# Altium schematic sheet 22 COMM CHANNEL STEERIN.SchDoc
size 513 x 386 mm
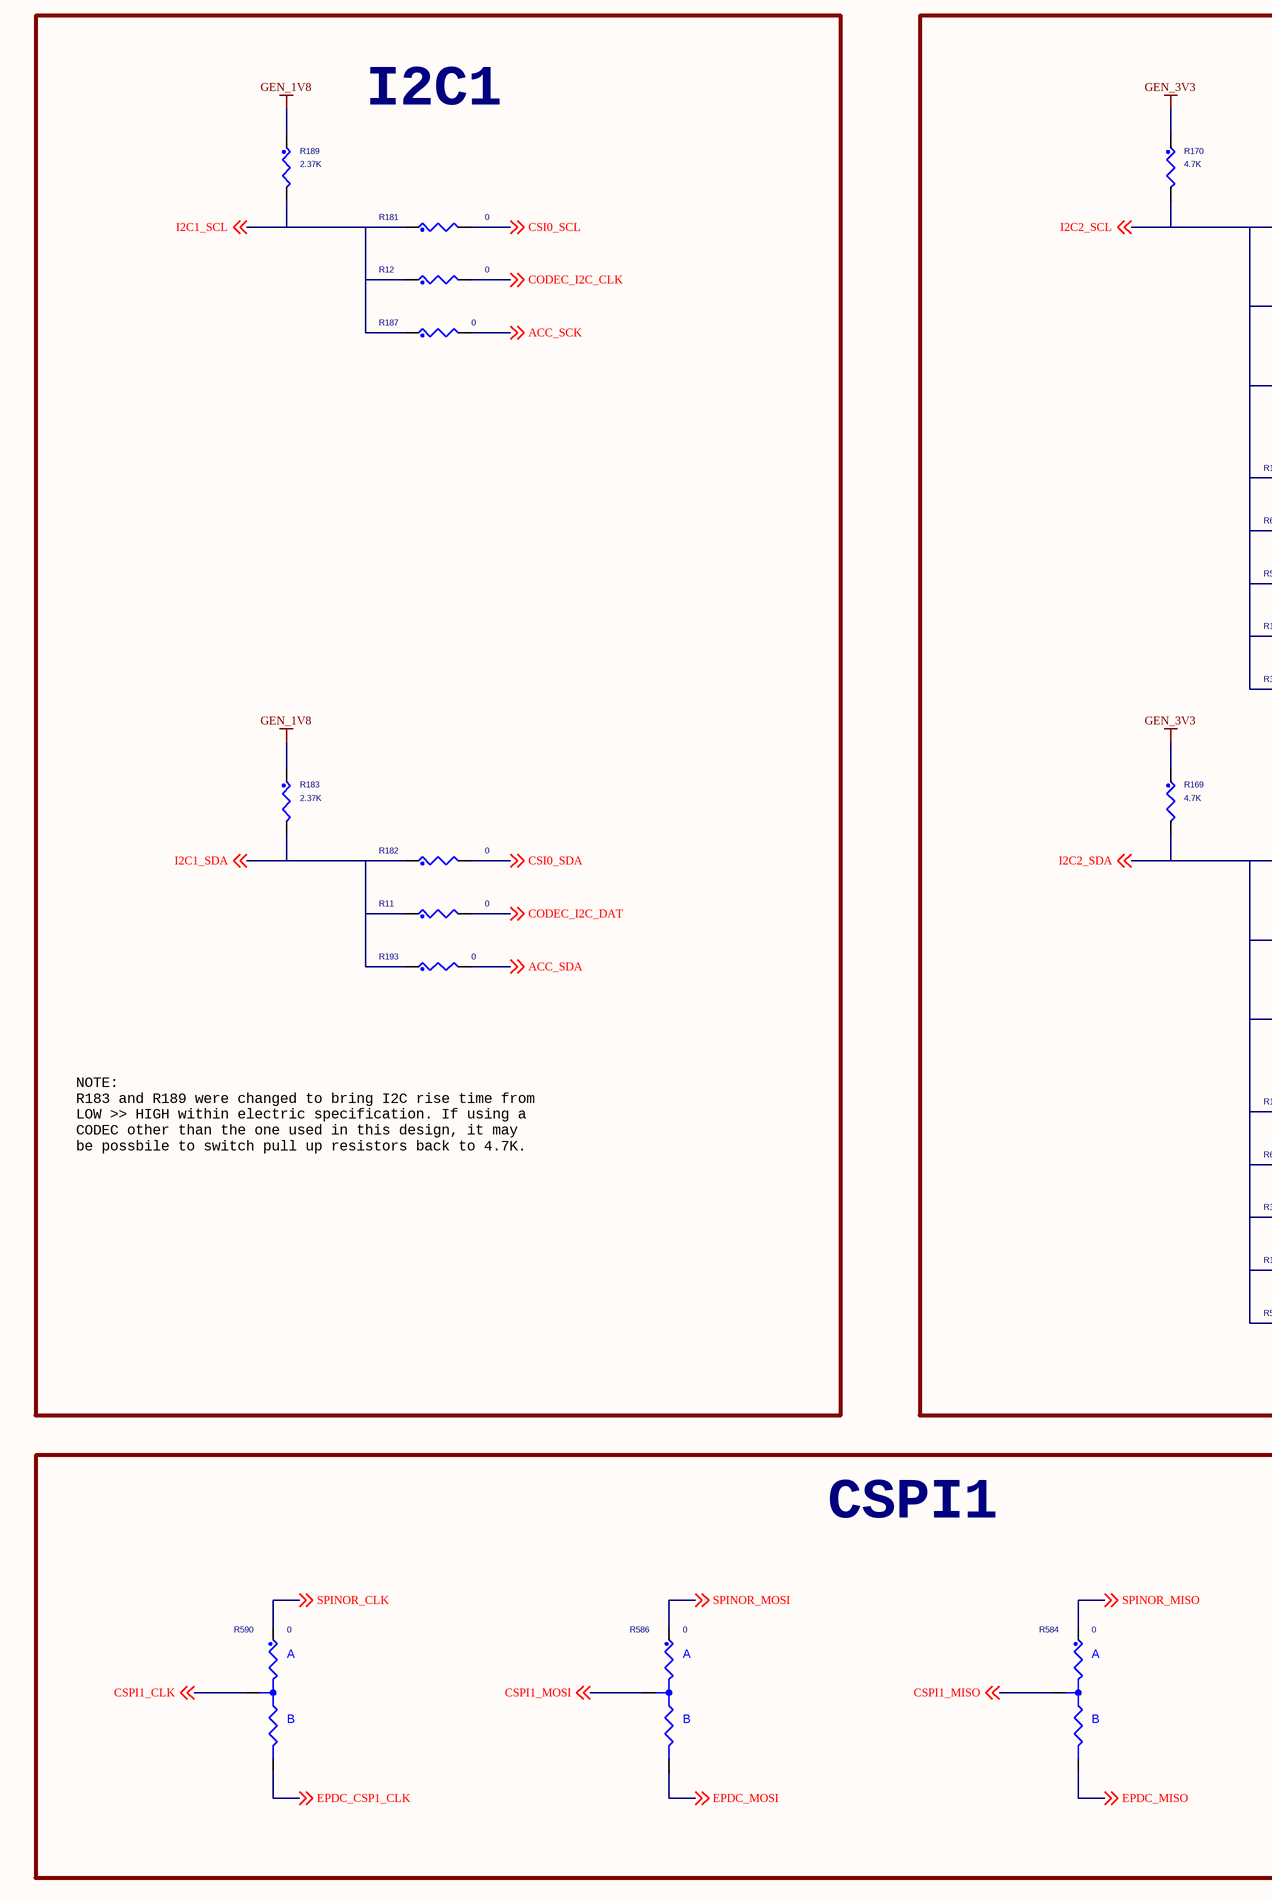
[diagram p0: 22 COMM CHANNEL STEERIN.SchDoc, left]
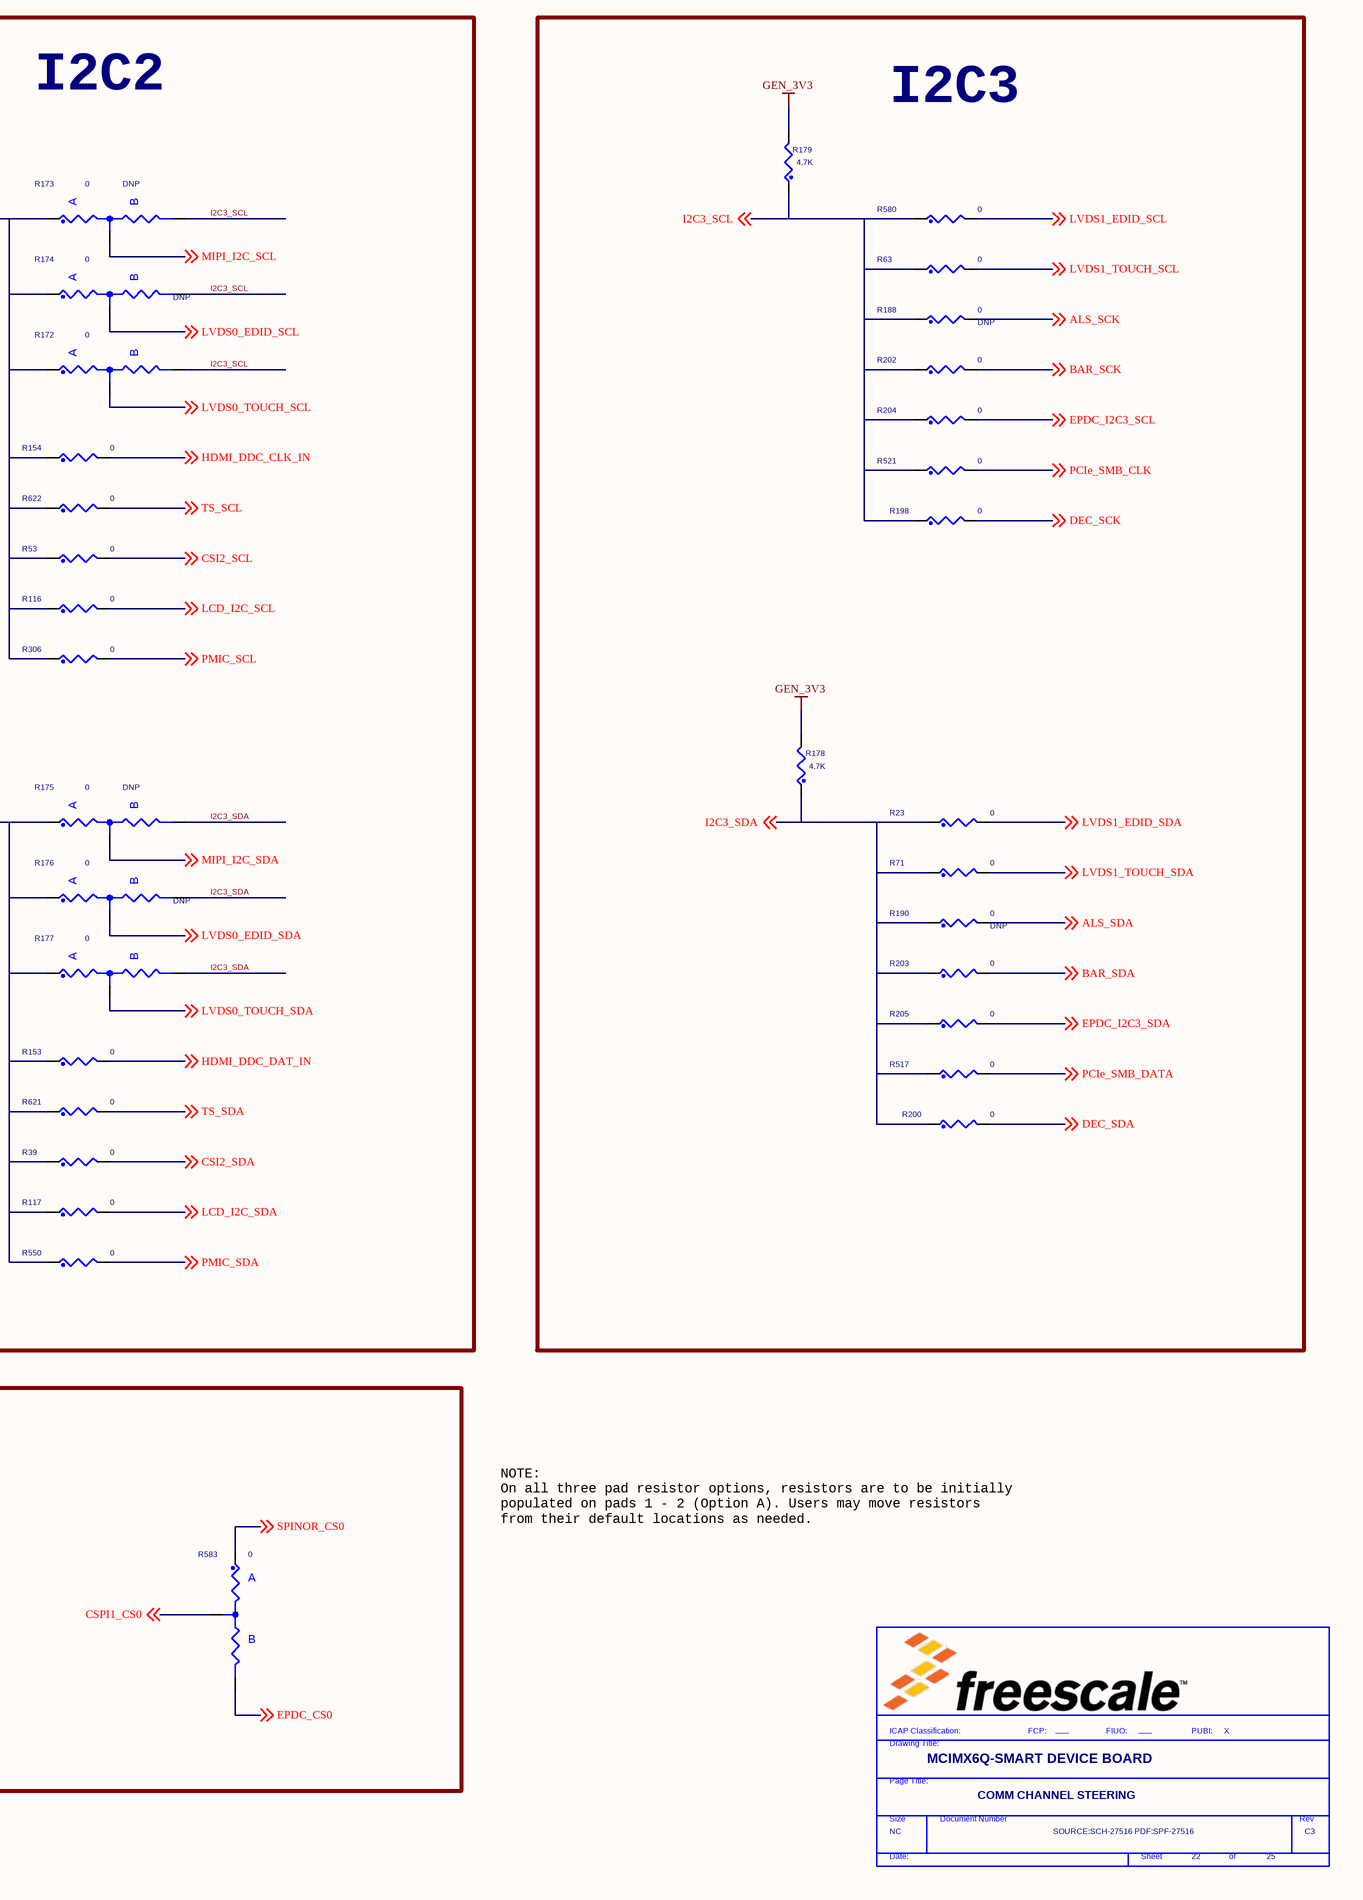
[diagram p1: 22 COMM CHANNEL STEERIN.SchDoc, right]

## Parts
*  FIUO: ___  PUBI: X  Doc: SOURCE:SCH-27516 PDF:SPF-27516  RevCode: C3  Title: MCIMX6Q-SMART DEVICE BOARD  Page Size: NC  Page Number: 22  Page Count: 25  PageTitle: COMM CHANNEL STEERING  (hidden comment: TitleBlock_FS)  (graphical)
R11  0  [0402_CC]
R12  0  [0402_CC]
R23  0  [0402_CC]
R39  0  [0402_CC]
R53  0  [0402_CC]
R63  0  [0402_CC]
R71  0  [0402_CC]
R116  0  [0402_CC]
R117  0  [0402_CC]
R153  0  [0402_CC]
R154  0  [0402_CC]
R169  4.7K  [0402_CC]
R170  4.7K  [0402_CC]
R172  0  [R603-X2]
R173  0  ASSY_OPT: DNP  [R603-X2]
R174  0  ASSY_OPT: DNP  [R603-X2]
R175  0  ASSY_OPT: DNP  [R603-X2]
R176  0  ASSY_OPT: DNP  [R603-X2]
R177  0  [R603-X2]
R178  4.7K  [0402_CC]
R179  4.7K  [0402_CC]
R181  0  [0402_CC]
R182  0  [0402_CC]
R183  2.37K  [0402_CC]
R187  0  [0402_CC]
R188  0  ASSY_OPT: DNP  [0402_CC]
R189  2.37K  [0402_CC]
R190  0  ASSY_OPT: DNP  [0402_CC]
R193  0  [0402_CC]
R198  0  [0402_CC]
R200  0  [0402_CC]
R202  0  [0402_CC]
R203  0  [0402_CC]
R204  0  [0402_CC]
R205  0  [0402_CC]
R306  0  [0402_CC]
R517  0  [0402_CC]
R521  0  [0402_CC]
R550  0  [0402_CC]
R580  0  [0402_CC]
R583  0  [R603-X2]
R584  0  [R603-X2]
R586  0  [R603-X2]
R590  0  [R603-X2]
R621  0  [0402_CC]
R622  0  [0402_CC]

## Blocks framed on the sheet
I2C1: R11 R12 R181-R183 R187 R189 R193
I2C2: R39 R53 R116 R117 R153 R154 R169 R170 R172-R177 R306 R550 R621 R622
I2C3: R23 R63 R71 R178 R179 R188 R190 R198 R200 R202-R205 R517 R521 R580
CSPI1: R583 R584 R586 R590

## Nets
GEN_1V8: R183.1 R189.1
GEN_3V3: R169.1 R170.1 R178.2 R179.2
ACC_SCK: R187.2 ; off-sheet ACC_SCK
ACC_SDA: R193.2 ; off-sheet ACC_SDA
ALS_SCK: R188.2 ; off-sheet ALS_SCK
ALS_SDA: R190.2 ; off-sheet ALS_SDA
BAR_SCK: R202.2 ; off-sheet BAR_SCK
BAR_SDA: R203.2 ; off-sheet BAR_SDA
CODEC_I2C_CLK: R12.2 ; off-sheet CODEC_I2C_CLK
CODEC_I2C_DAT: R11.2 ; off-sheet CODEC_I2C_DAT
CSI0_SCL: R181.2 ; off-sheet CSI0_SCL
CSI0_SDA: R182.2 ; off-sheet CSI0_SDA
CSI2_SCL: R53.2 ; off-sheet CSI2_SCL
CSI2_SDA: R39.2 ; off-sheet CSI2_SDA
CSPI1_CLK: R590.2 ; off-sheet CSPI1_CLK
CSPI1_CS0: R583.2 ; off-sheet CSPI1_CS0
CSPI1_MISO: R584.2 ; off-sheet CSPI1_MISO
CSPI1_MOSI: R586.2 ; off-sheet CSPI1_MOSI
DEC_SCK: R198.2 ; off-sheet DEC_SCK
DEC_SDA: R200.2 ; off-sheet DEC_SDA
EPDC_CS0: R583.3 ; off-sheet EPDC_CS0
EPDC_CSP1_CLK: R590.3 ; off-sheet EPDC_CSP1_CLK
EPDC_I2C3_SCL: R204.2 ; off-sheet EPDC_I2C3_SCL
EPDC_I2C3_SDA: R205.2 ; off-sheet EPDC_I2C3_SDA
EPDC_MISO: R584.3 ; off-sheet EPDC_MISO
EPDC_MOSI: R586.3 ; off-sheet EPDC_MOSI
HDMI_DDC_CLK_IN: R154.2 ; off-sheet HDMI_DDC_CLK_IN
HDMI_DDC_DAT_IN: R153.2 ; off-sheet HDMI_DDC_DAT_IN
I2C1_SCL: R12.1 R181.1 R187.1 R189.2 ; off-sheet I2C1_SCL
I2C1_SDA: R11.1 R182.1 R183.2 R193.1 ; off-sheet I2C1_SDA
I2C2_SCL: R53.1 R116.1 R154.1 R170.2 R172.1 R173.1 R174.1 R306.1 R622.1 ; off-sheet I2C2_SCL
I2C2_SDA: R39.1 R117.1 R153.1 R169.2 R175.1 R176.1 R177.1 R550.1 R621.1 ; off-sheet I2C2_SDA
I2C3_SCL: R63.1 R172.3 R173.3 R174.3 R179.1 R188.1 R198.1 R202.1 R204.1 R521.1 R580.1 ; off-sheet I2C3_SCL
I2C3_SDA: R23.1 R71.1 R175.3 R176.3 R177.3 R178.1 R190.1 R200.1 R203.1 R205.1 R517.1 ; off-sheet I2C3_SDA
LCD_I2C_SCL: R116.2 ; off-sheet LCD_I2C_SCL
LCD_I2C_SDA: R117.2 ; off-sheet LCD_I2C_SDA
LVDS0_EDID_SCL: R174.2 ; off-sheet LVDS0_EDID_SCL
LVDS0_EDID_SDA: R176.2 ; off-sheet LVDS0_EDID_SDA
LVDS0_TOUCH_SCL: R172.2 ; off-sheet LVDS0_TOUCH_SCL
LVDS0_TOUCH_SDA: R177.2 ; off-sheet LVDS0_TOUCH_SDA
LVDS1_EDID_SCL: R580.2 ; off-sheet LVDS1_EDID_SCL
LVDS1_EDID_SDA: R23.2 ; off-sheet LVDS1_EDID_SDA
LVDS1_TOUCH_SCL: R63.2 ; off-sheet LVDS1_TOUCH_SCL
LVDS1_TOUCH_SDA: R71.2 ; off-sheet LVDS1_TOUCH_SDA
MIPI_I2C_SCL: R173.2 ; off-sheet MIPI_I2C_SCL
MIPI_I2C_SDA: R175.2 ; off-sheet MIPI_I2C_SDA
PCIe_SMB_CLK: R521.2 ; off-sheet PCIe_SMB_CLK
PCIe_SMB_DATA: R517.2 ; off-sheet PCIe_SMB_DATA
PMIC_SCL: R306.2 ; off-sheet PMIC_SCL
PMIC_SDA: R550.2 ; off-sheet PMIC_SDA
SPINOR_CLK: R590.1 ; off-sheet SPINOR_CLK
SPINOR_CS0: R583.1 ; off-sheet SPINOR_CS0
SPINOR_MISO: R584.1 ; off-sheet SPINOR_MISO
SPINOR_MOSI: R586.1 ; off-sheet SPINOR_MOSI
TS_SCL: R622.2 ; off-sheet TS_SCL
TS_SDA: R621.2 ; off-sheet TS_SDA

## Notes on the sheet
- NOTE:
  R183 and R189 were changed to bring I2C rise time from
  LOW >> HIGH within electric specification. If using a
  CODEC other than the one used in this design, it may
  be possbile to switch pull up resistors back to 4.7K.
- NOTE:
  On all three pad resistor options, resistors are to be initially
  populated on pads 1 - 2 (Option A). Users may move resistors
  from their default locations as needed.
- (in symbol RES_0603_X2) A; B
- (in symbol TitleBlock_FS) ICAP Classification:; FCP:; FIUO:; PUBI:; Drawing Title:; Page Title:; Size; Document Number; Rev; Date:; Sheet; of

## Library data of the parts
* = TitleBlock_FS: OrgAddr2: Austin, TX 78735-8598; OrgAddr1: 6501 William Cannon Drive West; OrgName: Freescale Semiconductor; FCP: ___; Page Create Date: March  8, 1995
R11 R12 R53 R63 R71 R116 R154 R181 R182 R187 R188 R190 R193 R202 R517 R550 R622 = RES: RES MF ZERO OHM 1/10W -- 0402; CLASS: DISCRETE; FPLIST: RC0402_25,RC0402_HD,RC0402_X2,0402_CC; CAD_APPROVED: Yes; MFG_PN01: ERJ-2GE0R00X; MFG_NAME01: Panasonic; AGILE_PN: 470-79965; SIGNAL_MODEL: DEFAULT_RESISTOR_0.001OHM_2_1; ROHS: Yes
R23 R580 = RES: RES MF ZERO OHM 1/10W -- 0402; CLASS: DISCRETE; SIGNAL_MODEL: DEFAULT_RESISTOR_0.001OHM_2_1; AGILE_PN: 470-79965; MFG_NAME01: Panasonic; MFG_PN01: ERJ-2GE0R00X; CAD_APPROVED: Yes; FPLIST: RC0402_25,RC0402_HD,RC0402_X2,0402_CC; ROHS: Yes
R39 R117 R153 R198 R200 R203-R205 R521 R621 = RES: RES MF ZERO OHM 1/10W -- 0402; CLASS: DISCRETE; AGILE_PN: 470-79965; MFG_NAME01: Panasonic; MFG_PN01: ERJ-2GE0R00X; CAD_APPROVED: Yes; FPLIST: RC0402_25,RC0402_HD,RC0402_X2,0402_CC; SIGNAL_MODEL: DEFAULT_RESISTOR_0.001OHM_2_1; ROHS: Yes
R169 R170 R178 R179 = RES: RES MF 4.70K 1/16W 1% 0402; CLASS: DISCRETE; PRIORITY_PN: 006-00619; CAD_APPROVED: Yes; MFG_PN01: RK73H1ETTP4701F; MFG_NAME01: KOA SPEER; AGILE_PN: 470-75418; SIGNAL_MODEL: DEFAULT_RESISTOR_4700OHM_2_1; Tolerance: 1%; ROHS: Yes
R172-R177 R583 R584 R586 R590 = RES_0603_X2: RES MF ZERO OHM 1/10W -- 0603; CLASS: DISCRETE; FPLIST: RC0603_OV,RC0603,R603-X2,0603_CC; CAD_APPROVED: Yes; MFG_PN01: CRCW06030000Z0EA; MFG_NAME01: VISHAY INTERTECHNOLOGY; Tolerance: 1%; AGILE_PN: 470-75407; ROHS: Yes
R183 R189 = RES: RES MF 2.37K  1/16W 1% 0402; CLASS: DISCRETE; FPLIST: RC0402_25,RC0402_HD,0402_CC; CAD_APPROVED: Yes; MFG_PN01: RK73H1ETTP2371F; MFG_NAME01: KOA SPEER; AGILE_PN: 470-30874; ROHS: Yes; Tolerance: 1%
R306 = RES: RES MF ZERO OHM 1/10W -- 0402; CLASS: DISCRETE; SIGNAL_MODEL: DEFAULT_RESISTOR_0.001OHM_2_1; FPLIST: RC0402_25,RC0402_HD,RC0402_X2,0402_CC; CAD_APPROVED: Yes; MFG_PN01: ERJ-2GE0R00X; MFG_NAME01: Panasonic; AGILE_PN: 470-79965; ROHS: Yes